# Altium schematic sheet Power_Load_LEDs10mA.SchDoc
size A4; SheetNumber: 8; SheetTotal: 8
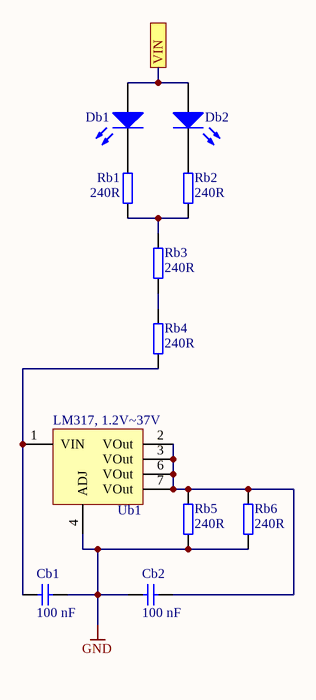
[diagram p0: Power_Load_LEDs10mA.SchDoc]

## Parts
Cb1  100 nF  [C_0603_TE]
Cb2  100 nF  [C_0603_TE]
Db1  LED Blue  [WL-SMCW_0603]  (value not drawn)
Db2  LED Blue  [WL-SMCW_0603]  (value not drawn)
Rb1  240R  [R_0603_TE]
Rb2  240R  [R_0603_TE]
Rb3  240R  [R_0603_TE]
Rb4  240R  [R_0603_TE]
Rb5  240R  [R_0603_TE]
Rb6  240R  [R_0603_TE]
Ub1  LM317, 1.2V~37V  [SOIC127P600X175-8N]

## Ports
VIN

## Nets
GND: Cb1.1 Cb2.2 Rb5.1 Rb6.2 Ub1.4(ADJ)
VIN: Db1.2(A) Db2.2(A) ; port VIN
NetCb1_2: Cb1.2 Rb4.2 Ub1.1(VIN)
NetCb2_1: Cb2.1 Rb5.2 Rb6.1 Ub1.2(VOut) Ub1.3(VOut) Ub1.6(VOut) Ub1.7(VOut)
NetDb1_1: Db1.1(K) Rb1.2
NetDb2_1: Db2.1(K) Rb2.1
NetRb1_1: Rb1.1 Rb2.2 Rb3.2
NetRb3_1: Rb3.1 Rb4.1

## Notes on the sheet
- Title
- Revision:
- Design Engineer:
- Date:
- Project:
- Sheet
- of

## Library data of the parts
Cb1 Cb2 = UZgen_C_0603_100nF_50V_X7R: Generic capacitor; Manufacturer: UZgen; Voltage: 50V; Tolerance: 10 %; Created from: AGeiger; Manufacturer Part Number: UZgen_C_0603_100nF_50V_X7R; PartID: 1; Created On: 02/07/2024 14:42:23; Value: 100 nF; Device Package: 0603; Technology: X7R; Mounting Type: SMD; Last Updated: 08/08/2024 15:01:15
Db1 Db2 = LTST-C191TBKT: -20℃~+80℃ 104mcd 130° 20mA 3.3V 465nm~475nm 468nm 75mW Blue Discrete Diode Water Clear 0603 LED Indication; Manufacturer: LITE-ON Technology Corp.; Created from: UZgenTool; Forward Voltage U_f: 2.8 V to 3.8 V; Manufacturer Part Number: LTST-C191TBKT; PartID: 36; Created On: 23/04/2026 18:47:30; ComponentLink1Description: Datasheet; ComponentLink1URL: https://optoelectronics.liteon.com/upload/download/DS22-2000-230/LTST-C191TBKT.pdf; Component Type: LED Diode; Device Package: 0603; Last Updated: 23/04/2026 18:47:30; Mounting Type: SMD; Operating Temperature: -20°C to +80°C; Supplier 1: LCSC; Supplier Part Number 1: C99290; Type: Standard; Value: LED Blue; Live Cycle Status: 1; Stock number: not stored; Color: blue; Forward Current I_f: 20 mA; Wavelength: 468 nm; LCSC Part Number: C99290
Rb1-Rb6 = UZgen_R_0603_240R: Generic resistor; Manufacturer: UZgen; Tolerance: 1 %; Created from: UZgenTool; Manufacturer Part Number: UZgen_R_0603_240R; PartID: 206; Created On: 02/07/2024 17:29:49; Value: 240R; Device Package: 0603; Mounting Type: SMD; Last Updated: 02/07/2024 17:29:49
Ub1 = LM317LD13TR: Adjustable Over Temperature Protection、Short Circuit Protection Positive SOIC-8 Voltage Regulators - Linear, Low Drop Out (LDO) Regulators ROHS; Manufacturer: STMicroelectronics; Created from: FRosner; Manufacturer Part Number: LM317LD13TR; PartID: 27; Created On: 23/04/2026 08:27:09; ComponentLink1Description: Datasheet; ComponentLink1URL: https://www.st.com/resource/en/datasheet/lm217l.pdf; Component Type: LDO; Device Package: SOIC-8; Last Updated: 23/04/2026 08:27:09; Mounting Type: SMD; Operating Temperature: 0 to +125 °C; Series: LM317L; Supplier 1: LCSC; Supplier Part Number 1: C81457; Type: LDO; Value: LM317, 1.2V~37V; Live Cycle Status: 1; LCSC Part Number: C81457; Stock number: not stored